# Altium schematic sheet Red_Light_Check.SchDoc: TSAL_Inverter Enclosure
size 420 x 297 mm; Date: 23/04/24; DrawnBy: Georgios Papandreou; Revision: 4; SheetNumber: 2; SheetTotal: 4; CarNum: E5; CurrentSheet: 2; TotalSheet: 3
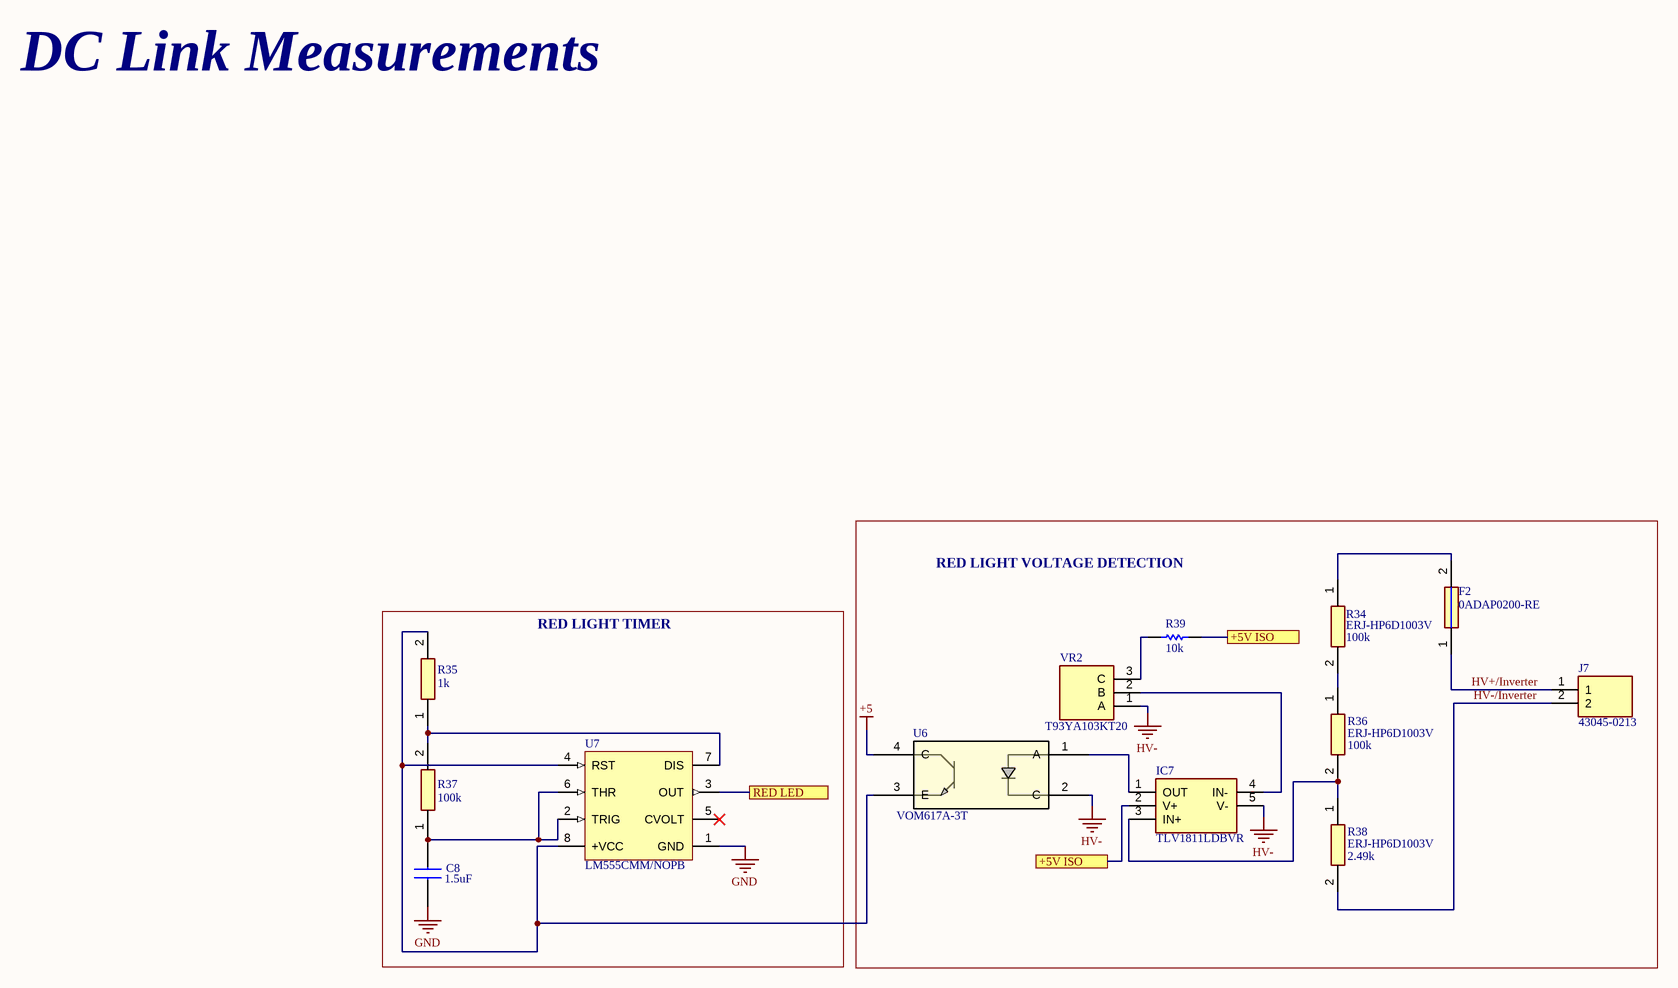
[diagram p0: Red_Light_Check.SchDoc]

## Parts
C8  C1005X6S0G155M050BC  [CAPC1005X55N]  (value not drawn)
F2  0ADAP0200-RE  [0ADAP0200RE]
IC7  TLV1811LDBVR  [SOT95P280X145-5N]
J7  43045-0213  [43045-02YY_121314]
R34  ERJ-HP6D1003V  [ERJHP6D1000V]
R35  RA73F1J1K0BTDF  [RESC1608X58N]  (value not drawn)
R36  ERJ-HP6D1003V  [ERJHP6D1000V]
R37  RK73H2ATTD1003F  [RESC2012X60N]  (value not drawn)
R38  ERJ-HP6D1003V  [ERJHP6D1000V]
R39  CRCW080510K0FKEC  [RESC2013X50X30ML20T20]  (value not drawn)
U6  VOM617A-3T  [SMD-4_VOM617A_VIS]
U7  LM555CMM/NOPB  [DGK0008A_N]
VR2  T93YA103KT20  [T93YA5K10]

## Blocks framed on the sheet
RED LIGHT VOLTAGE DETECTION: F2 IC7 J7 R34 R36 R38 R39 U6 VR2
RED LIGHT TIMER: C8 R35 R37 U7

## Ports
+5V ISO (see Green_Light_Check[5B], Red_Light_Check[3C], TSAC_Logic[4B], TSAC_Logic[5A]), +5V ISO (see Green_Light_Check[5B], Red_Light_Check[4B], TSAC_Logic[4B], TSAC_Logic[5A]), RED LED (see Green_Light_Check[1B])

## Nets
+5: U6.4(C)
GND: C8.1 U7.1(GND)
HV-: IC7.5(V-) U6.2(C) VR2.1(A)
+5V ISO: IC7.2(V+) R39.1 ; port +5V ISO
HV+/Inverter: F2.1 J7.1
HV-/Inverter: J7.2 R38.2
RED LED: U7.3(OUT) ; port RED LED
NetC8_2: C8.2 R37.1 U7.2(TRIG) U7.6(THR)
NetF2_2: F2.2 R34.1
NetIC7_1: IC7.1(OUT) U6.1(A)
NetIC7_3: IC7.3(IN+) R36.2 R38.1
NetIC7_4: IC7.4(IN-) VR2.2(B)
NetR34_2: R34.2 R36.1
NetR35_1: R35.1 R37.2 U7.7(DIS)
NetR35_2: R35.2 U6.3(E) U7.4(RST) U7.8(+VCC)
NetR39_2: R39.2 VR2.3(C)

Not connected (* = marked no-connect by the designer): U7 5(CVOLT)*

## Notes on the sheet
- DC Link Measurements
- (near R39) 10k
- (near R34) 100k
- (near R35) 1k
- (near R37) 100k
- (near R36) 100k
- (near R38) 2.49k
- (near C8) 1.5uF
- TITLE
- DATE
- DRAWN BY
- CAR NUMBER
- SIZE
- REV
- SHEET
- A3
- /

## Library data of the parts
C8 = C1005X6S0G155M050BC: MULTILAYER CERAMIC CHIP CAPACITORS, 1005, Commercial grade, general (Up to 75V); Manufacturer_Name: TDK; Geometry.Height: 0.55mm; Mouser Part Number: *; Mouser Price/Stock: *; Manufacturer_Part_Number: C1005X6S0G155M050BC; Datasheet Link: https://product.tdk.com/info/en/catalog/datasheets/mlcc_commercial_midvoltage_en.pdf
F2 = 0ADAP0200-RE: Fuse; Manufacturer_Name: BelFuse; Datasheet Link: https://www.belfuse.com/resources/datasheets/circuitprotection/ds-cp-0adax-series.pdf; Height: 7.06mm; Manufacturer_Part_Number: 0ADAP0200-RE; Mouser Part Number: 530-0ADAP0200-RE; Mouser Price/Stock: https://www.mouser.co.uk/ProductDetail/Bel-Fuse/0ADAP0200-RE?qs=chTDxNqvsylLbV%252B5gr9f%252Bw%3D%3D; Arrow Part Number: 0ADAP0200-RE; Arrow Price/Stock: https://www.arrow.com/en/products/0adap0200-re/bel-group
IC7 = TLV1811LDBVR: Integrated Circuit; Manufacturer_Name: Texas Instruments; Datasheet Link: https://www.ti.com/lit/ds/symlink/tlv1811.pdf?ts=1674252464539&ref_url=https%253A%252F%252Fwww.ti.com%252Fproduct%252FTLV1811; Height: 1.45mm; Manufacturer_Part_Number: TLV1811LDBVR; Mouser Part Number: 595-TLV1811LDBVR; Mouser Price/Stock: https://www.mouser.co.uk/ProductDetail/Texas-Instruments/TLV1811LDBVR?qs=rQFj71Wb1eX09MzTfpxERg%3D%3D; Arrow Part Number: TLV1811LDBVR; Arrow Price/Stock: https://www.arrow.com/en/products/tlv1811ldbvr/texas-instruments?region=nac
J7 = 43045-0213: Connector; Manufacturer_Name: Molex; Datasheet Link: https://www.molex.com/pdm_docs/sd/430450612_sd.pdf; Height: 9.91mm; Manufacturer_Part_Number: 43045-0213; Mouser Part Number: 538-43045-0213; Mouser Price/Stock: https://www.mouser.co.uk/ProductDetail/Molex/43045-0213?qs=4XSMV6Twtb2ziNgaS7IgsA%3D%3D
R34 R36 R38 = CMP-067-000016-1: Resistor; Manufacturer_Name: Panasonic; Source: SamacSys.SchLib; Height: 0.7mm; Design Item ID: ERJ-HP6D1003V; Datasheet Link: http://industrial.panasonic.com/cdbs/www-data/pdf/RDQ0000/ast-ind-151033.pdf; Manufacturer_Part_Number: ERJ-HP6D1003V
R35 = RA73F1J1K0BTDF: Resistor; Manufacturer_Name: TE Connectivity; Datasheet Link: https://www.te.com/commerce/DocumentDelivery/DDEController?Action=srchrtrv&DocNm=1773270-3&DocType=Data%20Sheet&DocLang=English&PartCntxt=2-2176474-6&DocFormat=pdf; Height: 0.58mm; Manufacturer_Part_Number: RA73F1J1K0BTDF; Mouser Part Number: 279-RA73F1J1K0BTDF; Mouser Price/Stock: https://www.mouser.co.uk/ProductDetail/TE-Connectivity-Holsworthy/RA73F1J1K0BTDF?qs=Li%252BoUPsLEnve%2FJ8%252BWostNg%3D%3D
R37 = RK73H2ATTD1003F: Resistor; Manufacturer_Name: KOA Speer; Datasheet Link: http://www.koaspeer.com/catimages/Products/RK73H/RK73H.pdf; Height: 0.6mm; Manufacturer_Part_Number: RK73H2ATTD1003F; Mouser Part Number: 660-RK73H2ATTD1003F; Mouser Price/Stock: https://www.mouser.co.uk/ProductDetail/KOA-Speer/RK73H2ATTD1003F?qs=tLTLU8dkiwvHIdNanXejgQ%3D%3D; Arrow Part Number: RK73H2ATTD1003F; Arrow Price/Stock: https://www.arrow.com/en/products/rk73h2attd1003f/koa-speer-electronics?region=nac
R39 = CMP-1013-00623-2: Manufacturer: Vishay Dale; Part Number: CRCW080510K0FKEC
U6 = CMP-00030-45523145-1: VOM617A-3T Transistor Output Optocoupler, 1-Element, 3750V Isolation; Isolation Voltage: 3.75kV; Max Power Dissipation: 170mW; Max Output Voltage: 80V; Output Current per Channel: 100mA; Collector Emitter Saturation Voltage: 400mV; Number of Elements: 1; Max Input Current: 60mA; Fall Time: 12µs; Rise Time: 7µs; Forward Voltage: 1.6V; Current Transfer Ratio: 200%; Reverse Breakdown Voltage: 6V; Lead Free: Lead Free; Case/Package: SOP; Mount: Surface Mount; Min Operating Temperature: -55°C; Radiation Hardening: No; Width: 3.85mm; REACH SVHC: Unknown; Schedule B: 8541408000, 8541408000; Number of Pins: 4; Collector Emitter Breakdown Voltage: 80V; Forward Current: 60mA; Number of Channels: 1; RoHS: Compliant; Power Dissipation: 170mW; NexarPartId: 45523145; Length: 4.4mm; Input Current: 60mA; Collector Emitter Voltage (VCEO): 80V; Max Operating Temperature: 110°C; Output Voltage: 80V; Packaging: Tape & Reel; Max Collector Current: 100mA; Height: 2mm; Reverse Voltage (DC): 6V
U7 = CMP-0056-00152-3: Timer, 8-pin Mini SOIC, Pb-Free; Manufacturer: Texas Instruments; CompType: Analog IC; PowerWise: N; PackageTopMarking: ZXTT*Z55; ComponentLink1URL: http://www.ti.com/general/docs/lit/getliterature.tsp?genericPartNumber=LM555&fileType=pdf; PackageDescription: MINI SOIC, .118 x .118 x .034in, 8 Lead, .0256in Pitch; PinCount: 8; RoHS: Y; ComponentLink1Description: Datasheet URL; PackageReference: DGK0008A; Code_JEDEC: MO-187-AA
VR2 = T93YA103KT20: Variable Resistor; Manufacturer_Name: Vishay; Datasheet Link: https://www.vishay.com/docs/51026/t93.pdf; Height: 9mm; Manufacturer_Part_Number: T93YA103KT20; Mouser Part Number: 72-T93YA-10K; Mouser Price/Stock: https://www.mouser.co.uk/ProductDetail/Vishay-Sfernice/T93YA103KT20?qs=h4f6qdGYbthXcbdd7vDO0Q%3D%3D; Arrow Part Number: T93YA103KT20; Arrow Price/Stock: https://www.arrow.com/en/products/t93ya103kt20/vishay?region=nac